# Altium schematic sheet hole_field_direct.SchDoc
size A4
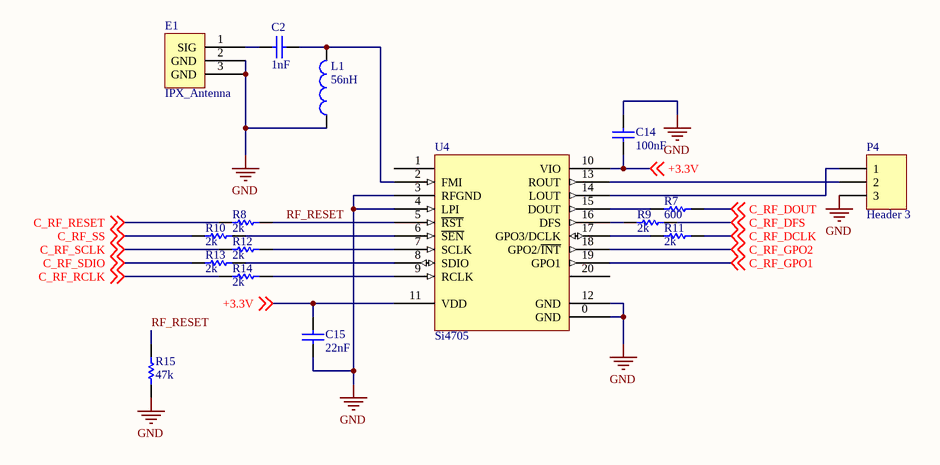
[diagram p0: hole_field_direct.SchDoc]

## Parts
C2  1nF  [CHIP0402]
C14  100nF  [CHIP0402]
C15  22nF  [CHIP0402]
E1  IPX_Antenna  [IPX-M]
L1  56nH  [0402-A]
P4  Header 3  [HDR1X3]
R7  600  [CHIP0402]
R8  2k  [CHIP0402]
R9  2k  [CHIP0402]
R10  2k  [CHIP0402]
R11  2k  [CHIP0402]
R12  2k  [CHIP0402]
R13  2k  [CHIP0402]
R14  2k  [CHIP0402]
R15  47k  [CHIP0402]
U4  Si4705  [QFN50P300X300X60-20N]

## Nets
GND: C14.2 C15.1 E1.2(GND) E1.3(GND) L1.1 P4.3 R15.1 U4.0(GND) U4.3(RFGND) U4.4(LPI) U4.12(GND)
+3.3V: C14.1 C15.2 U4.10(VIO) U4.11(VDD) ; off-sheet +3.3V
C_RF_DCLK: R11.2 ; off-sheet C_RF_DCLK
C_RF_DFS: R9.2 ; off-sheet C_RF_DFS
C_RF_DOUT: R7.2 ; off-sheet C_RF_DOUT
C_RF_GPO1: U4.19(GPO1) ; off-sheet C_RF_GPO1
C_RF_GPO2: U4.18(GPO2/~{INT}) ; off-sheet C_RF_GPO2
C_RF_RCLK: R14.1 ; off-sheet C_RF_RCLK
C_RF_RESET: R8.1 ; off-sheet C_RF_RESET
C_RF_SCLK: R12.1 ; off-sheet C_RF_SCLK
C_RF_SDIO: R13.1 ; off-sheet C_RF_SDIO
C_RF_SS: R10.1 ; off-sheet C_RF_SS
RF_RESET: R8.2 R15.2 U4.5(~{RST})
NetC2_1: C2.1 L1.2 U4.2(FMI)
NetC2_2: C2.2 E1.1(SIG)
NetP4_1: P4.1 U4.14(LOUT)
NetP4_2: P4.2 U4.13(ROUT)
NetR7_1: R7.1 U4.15(DOUT)
NetR9_1: R9.1 U4.16(DFS)
NetR10_2: R10.2 U4.6(~{SEN})
NetR11_1: R11.1 U4.17(GPO3/DCLK)
NetR12_2: R12.2 U4.7(SCLK)
NetR13_2: R13.2 U4.8(SDIO)
NetR14_2: R14.2 U4.9(RCLK)

Not connected (* = marked no-connect by the designer): U4 1(NC) 20(NC)

## Library data of the parts
C2 C14 C15 = Cap: Capacitor; Published: 8-Jun-2000; LatestRevisionDate: 17-Jul-2002; LatestRevisionNote: Re-released for DXP Platform.; PackageReference: RAD-0.3; Publisher: Altium Limited
  C2: Value: 1nF
  C14: Value: 100nF
  C15: Value: 22nF
L1 = Inductor: Code_IEC: 1005; Published: 8-Jun-2000; LatestRevisionDate: 29-May-2009; LatestRevisionNote: IPC-7351 Footprint Added.; PackageReference: 0402-A; Publisher: Altium Limited; PackageDescription: Chip Inductor; Code_JEITA: 0402; Value: 56nH
P4 = Header 3: Header, 3-Pin; LatestRevisionDate: 17-Jul-2002; LatestRevisionNote: Re-released for DXP Platform.; Publisher: Altium Limited
R7-R15 = Res1: Resistor; Published: 8-Jun-2000; LatestRevisionDate: 17-Jul-2002; LatestRevisionNote: Re-released for DXP Platform.; PackageReference: AXIAL-0.3; Publisher: Altium Limited
  R7: Value: 600
  R8-R14: Value: 2k
  R15: Value: 47k